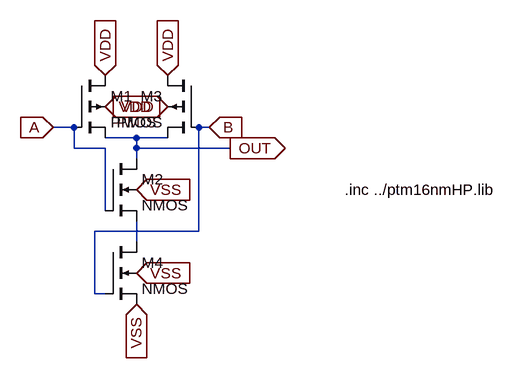
[diagram p0: schematic LOGIC_NAND_cCMOS.asc]
LOGIC_NAND_cCMOS.asc, the LTspice schematic file:
Version 4
SHEET 1 880 680
WIRE 16 80 -16 80
WIRE 224 80 208 80
WIRE 112 96 64 96
WIRE 160 96 112 96
WIRE 16 112 16 80
WIRE 64 112 16 112
WIRE 112 112 112 96
WIRE 256 112 112 112
WIRE 112 128 112 112
WIRE 64 208 64 112
WIRE 208 240 208 80
WIRE 208 240 48 240
WIRE 112 256 112 224
WIRE 48 336 48 240
WIRE 64 336 48 336
FLAG 112 352 VSS
IOPIN 112 352 In
FLAG 112 304 VSS
IOPIN 112 304 In
FLAG 112 176 VSS
IOPIN 112 176 In
FLAG 160 48 VDD
IOPIN 160 48 In
FLAG 64 48 VDD
IOPIN 64 48 In
FLAG 64 0 VDD
IOPIN 64 0 In
FLAG 160 0 VDD
IOPIN 160 0 In
FLAG -16 80 A
IOPIN -16 80 In
FLAG 224 80 B
IOPIN 224 80 In
FLAG 256 112 OUT
IOPIN 256 112 Out
SYMBOL pmos4 16 0 R0
SYMATTR InstName M1
SYMATTR Value2 l=16n w=450n
SYMBOL nmos4 64 128 R0
SYMATTR InstName M2
SYMATTR Value2 l=16n w=.4u
SYMBOL pmos4 208 0 M0
SYMATTR InstName M3
SYMATTR Value2 l=16n w=450n
SYMBOL nmos4 64 256 R0
SYMATTR InstName M4
SYMATTR Value2 l=16n w=0.8u
TEXT 432 176 Left 2 !.inc ../ptm16nmHP.lib

The netlist it stands for:
* LOGIC_NAND_cCMOS.asc
M1 VDD A OUT VDD PMOS l=16n w=450n
M2 OUT A N001 VSS NMOS l=16n w=.4u
M3 VDD B OUT VDD PMOS l=16n w=450n
M4 N001 B VSS VSS NMOS l=16n w=0.8u
.model NMOS NMOS
.model PMOS PMOS
.lib standard.mos
.inc ../ptm16nmHP.lib
.backanno
.end